# Altium schematic sheet Нижняя плата версия 3.0.SchDoc
size 594 x 420 mm; Author: ALTIUM GOSTBOM2.0 KEV; SheetNumber: 1; SheetTotal: 1; Обозначение_Код: НАПК0001.00.02Р; Наименование2: Модуль питания; п_Разраб_Р: Хейфец С.С.; п_Пров_Р: Хрущев А.С.; п_Утв_Р: Хейфец С.С.; Вид_документа_SCH: Схема принципиальная; Наименование_организации: Неясыти Аэро
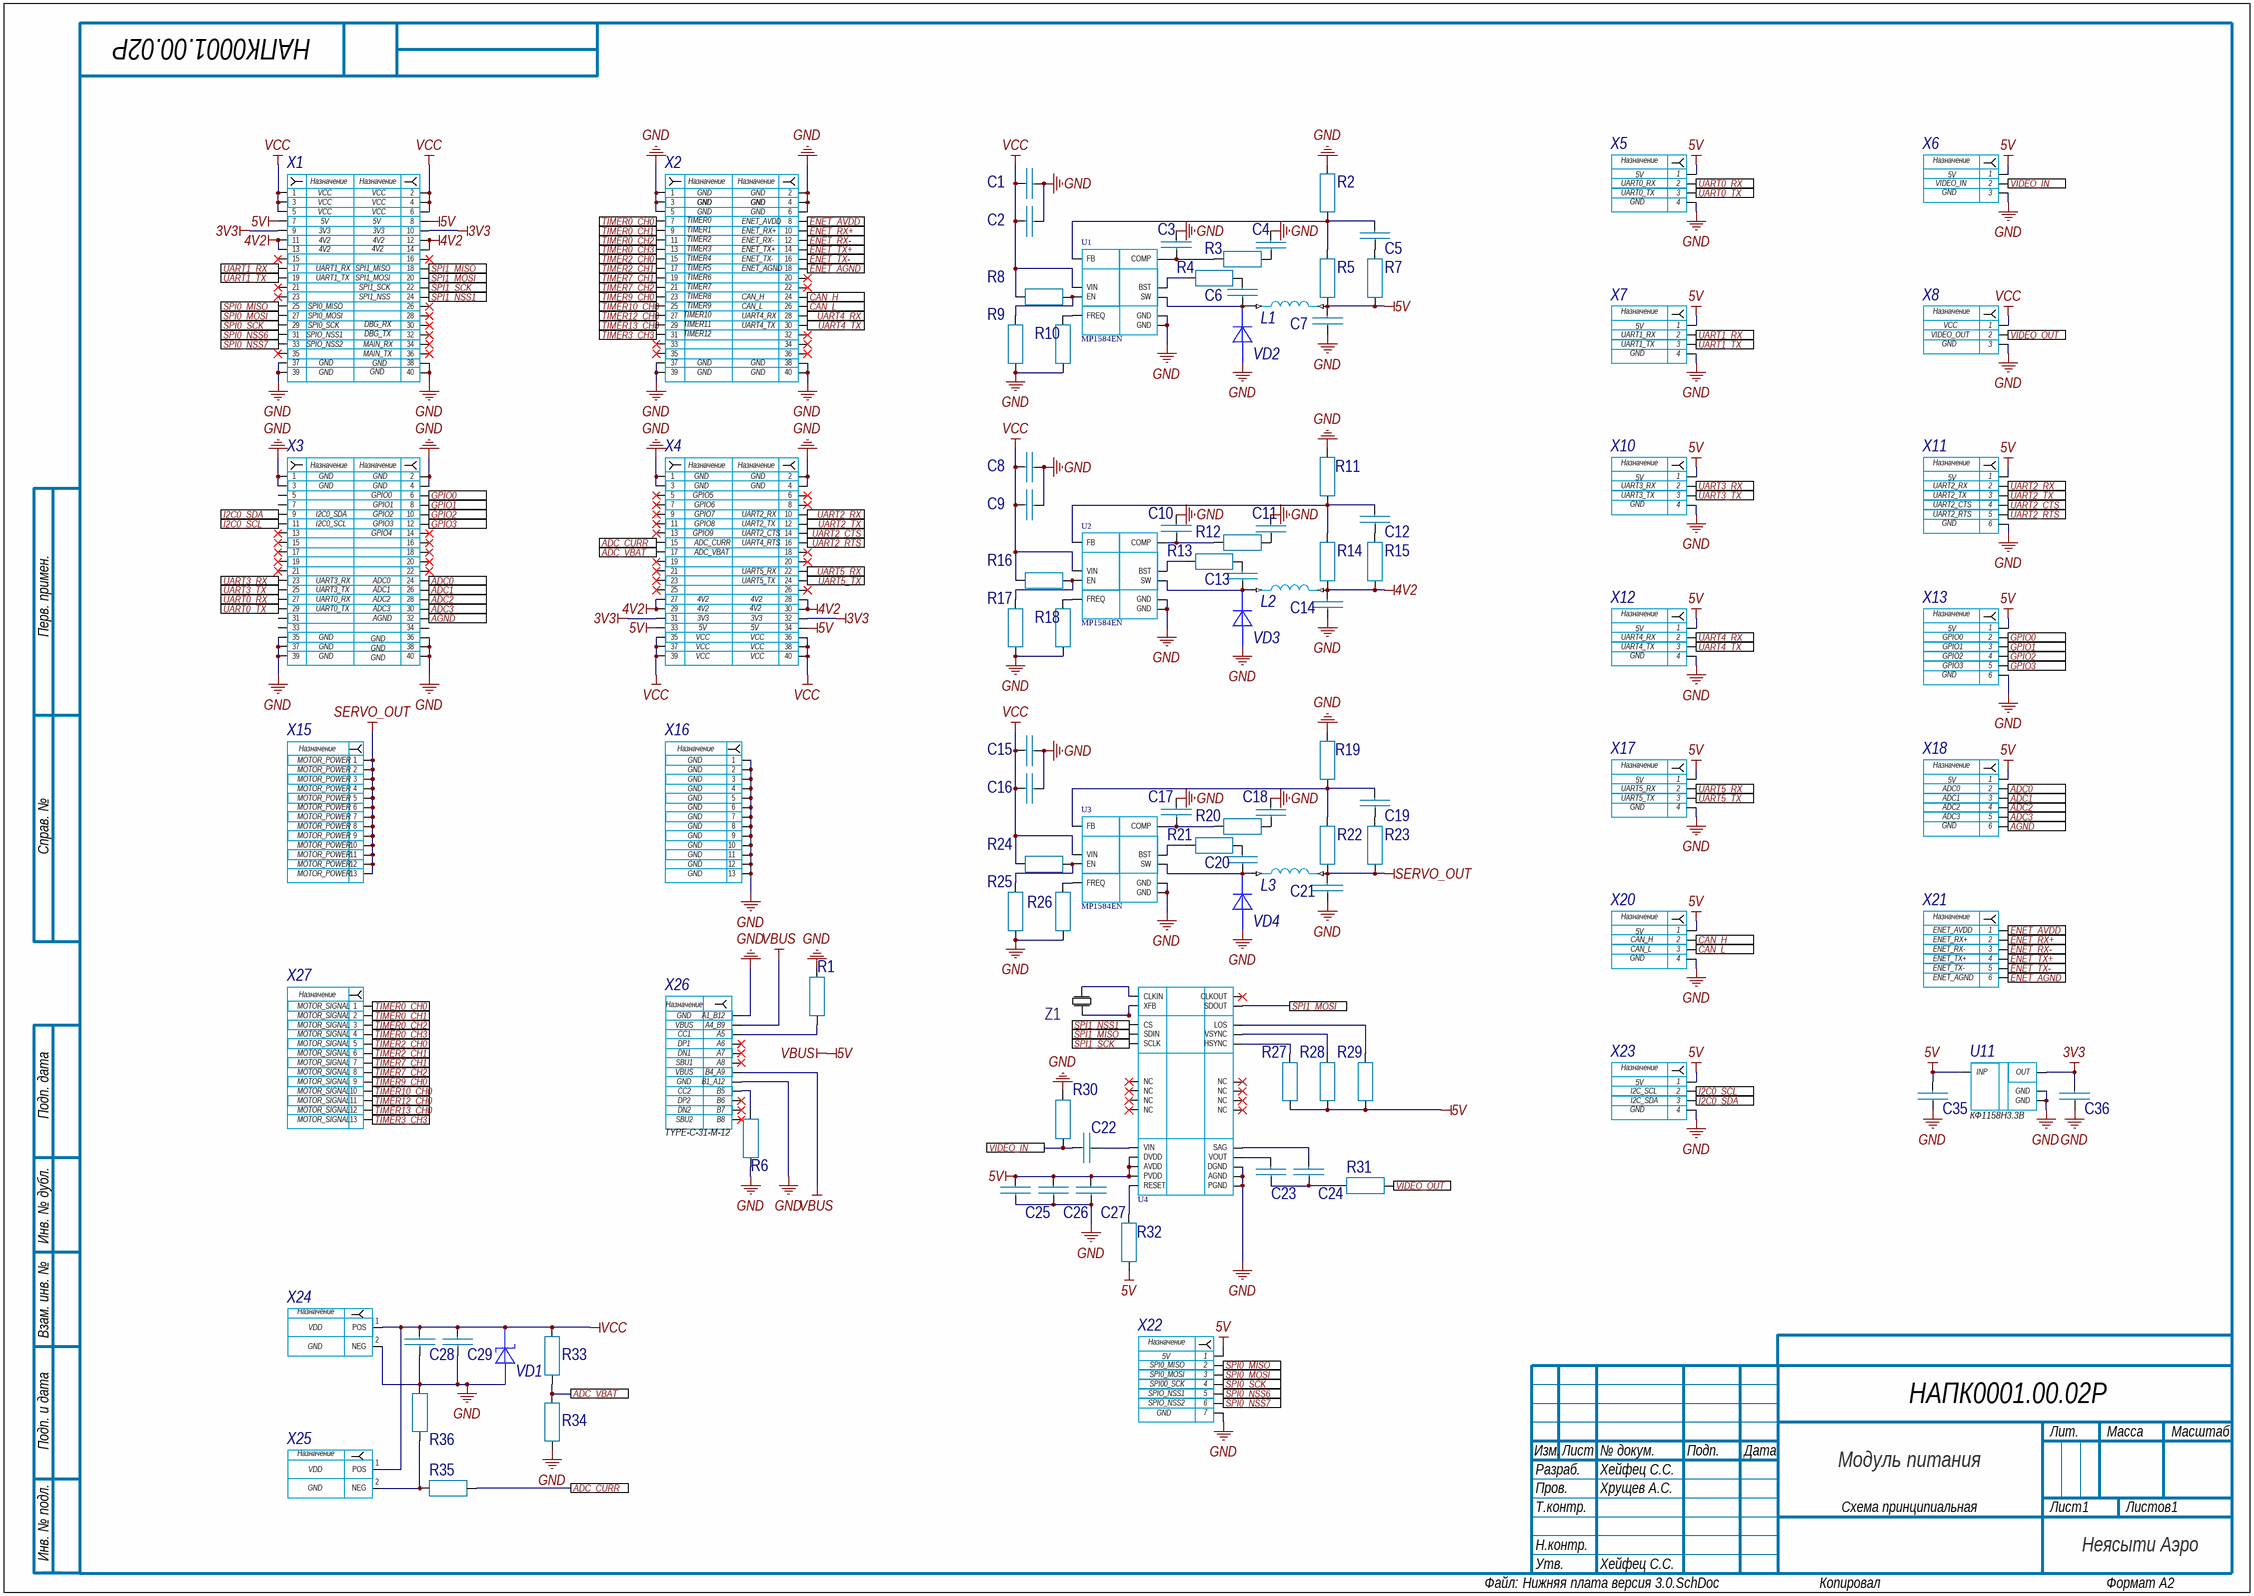
[diagram p0: Нижняя плата версия 3.0.SchDoc]

## Parts
C1  4u7  [C1206]  (value not drawn)
C2  100n  [C0603]  (value not drawn)
C3  1p  [C0603]  (value not drawn)
C4  220p  [C0603]  (value not drawn)
C5  (no value)  [C0603]
C6  100n  [C0603]  (value not drawn)
C7  22u  [C0603]  (value not drawn)
C8  4u7  [C1206]  (value not drawn)
C9  100n  [C0603]  (value not drawn)
C10  1p  [C0603]  (value not drawn)
C11  220p  [C0603]  (value not drawn)
C12  (no value)  [C0603]
C13  100n  [C0603]  (value not drawn)
C14  22u  [C0603]  (value not drawn)
C15  4u7  [C1206]  (value not drawn)
C16  100n  [C0603]  (value not drawn)
C17  1p  [C0603]  (value not drawn)
C18  220p  [C0603]  (value not drawn)
C19  (no value)  [C0603]
C20  100n  [C0603]  (value not drawn)
C21  22u  [C1206]  (value not drawn)
C22  (no value)  [C0603]
C23  22u  [C1206]  (value not drawn)
C24  22u  [C1206]  (value not drawn)
C25  100n  [C0603]  (value not drawn)
C26  100n  [C0603]  (value not drawn)
C27  100n  [C0603]  (value not drawn)
C28  22u  [C1206]  (value not drawn)
C29  22u  [C1206]  (value not drawn)
C35  (no value)  [C0603]
C36  (no value)  [C0603]
L1  4u7  [МИ-3]  (value not drawn)
L2  4u7  [МИ-3]  (value not drawn)
L3  4u7  [МИ-3]  (value not drawn)
R1  (no value)  [R0603]
R2  23K7  [R0603]  (value not drawn)
R3  133K  [R0603]  (value not drawn)
R4  0  [R0603]  (value not drawn)
R5  124K  [R0603]  (value not drawn)
R6  (no value)  [R0603]
R7  (no value)  [R0603]
R8  100K  [R0603]  (value not drawn)
R9  100K  [R0603]  (value not drawn)
R10  57K6  [R0603]  (value not drawn)
R11  29K4  [R0603]  (value not drawn)
R12  113K  [R0603]  (value not drawn)
R13  0  [R0603]  (value not drawn)
R14  124K  [R0603]  (value not drawn)
R15  (no value)  [R0603]
R16  100K  [R0603]  (value not drawn)
R17  100K  [R0603]  (value not drawn)
R18  57.6  [R0603]  (value not drawn)
R19  23K7  [R0603]  (value not drawn)
R20  113K  [R0603]  (value not drawn)
R21  0  [R0603]  (value not drawn)
R22  124K  [R0603]  (value not drawn)
R23  (no value)  [R0603]
R24  100K  [R0603]  (value not drawn)
R25  100K  [R0603]  (value not drawn)
R26  57.6  [R0603]  (value not drawn)
R27  1K  [R0603]  (value not drawn)
R28  1K  [R0603]  (value not drawn)
R29  1K  [R0603]  (value not drawn)
R30  75  [R0603]  (value not drawn)
R31  75  [R0603]  (value not drawn)
R32  10K  [R0603]  (value not drawn)
R33  100K  [R0603]  (value not drawn)
R34  10K  [R0603]  (value not drawn)
R35  10K  [R0603]  (value not drawn)
R36  0R001  [RESC6864X114N]  (value not drawn)
U1  MP1584EN  [SOIC127P600X170-9N]
U2  MP1584EN  [SOIC127P600X170-9N]
U3  MP1584EN  [SOIC127P600X170-9N]
U4  AT7456  [at7456]  (value not drawn)
U11  КФ1158Н3.3В  [SOT-428]
VD1  (no value)  [DO-214AA]
VD2  SS3P4  [DO-214AC]  (value not drawn)
VD3  SS3P4  [DO-214AC]  (value not drawn)
VD4  SS3P4  [DO-214AC]  (value not drawn)
X1  PLLD-1.27-40S  [Headr 2x20 male]  (value not drawn)
X2  PLLD-1.27-40S  [Headr 2x20 male]  (value not drawn)
X3  PLLD-1.27-40S  [Headr 2x20 male]  (value not drawn)
X4  PLLD-1.27-40S  [Headr 2x20 male]  (value not drawn)
X5  Molex Picoblade 0532610471  [PicoBlade 4pin]  (value not drawn)
X6  Molex Picoblade 0532610371  [PicoBlade 3pin]  (value not drawn)
X7  Molex Picoblade 0532610471  [PicoBlade 4pin]  (value not drawn)
X8  Molex Picoblade 0532610371  [PicoBlade 3pin]  (value not drawn)
X10  Molex Picoblade 0532610471  [PicoBlade 4pin]  (value not drawn)
X11  Molex Picoblade 0532610671  [PicoBlade 6pin]  (value not drawn)
X12  Molex Picoblade 0532610471  [PicoBlade 4pin]  (value not drawn)
X13  Molex Picoblade 0532610671  [PicoBlade 6pin]  (value not drawn)
X15  (no value)  [SERV]
X16  (no value)  [SERV]
X17  Molex Picoblade 0532610471  [PicoBlade 4pin]  (value not drawn)
X18  Molex Picoblade 0532610671  [PicoBlade 6pin]  (value not drawn)
X20  Molex Picoblade 0532610471  [PicoBlade 4pin]  (value not drawn)
X21  Molex Picoblade 0532610671  [PicoBlade 6pin]  (value not drawn)
X22  Molex Picoblade 0532610771  [PicoBlade 7pin]  (value not drawn)
X23  Molex Picoblade 0532610471  [PicoBlade 4pin]  (value not drawn)
X24  Amass XT-60-PW-M  [AMASS_XT60PW-M]  (value not drawn)
X25  Amass XT-60-PW-F  [AMASS_XT60PW-F]  (value not drawn)
X26  TYPE-C-31-M-12  [HRO_TYPE-C-31-M-12]
X27  (no value)  [SERV]
Z1  27MHz  [XTAL_NX5032GA-8.000M-STD-CSU-1]  (value not drawn)

## Ports
ADC0 (see Нижняя плата версия 3.0[1A]), ADC0 (see Нижняя плата версия 3.0[2A]), ADC1 (see Нижняя плата версия 3.0[1A]), ADC1 (see Нижняя плата версия 3.0[2A]), ADC2 (see Нижняя плата версия 3.0[1A]), ADC2 (see Нижняя плата версия 3.0[2B]), ADC3 (see Нижняя плата версия 3.0[1A]), ADC3 (see Нижняя плата версия 3.0[2B]), ADC_CURR (see Нижняя плата версия 3.0[1A]), ADC_CURR (see Нижняя плата версия 3.0[1B]), ADC_VBAT (see Нижняя плата версия 3.0[1A]), ADC_VBAT (see Нижняя плата версия 3.0[1B]), AGND (see Нижняя плата версия 3.0[1A]), AGND (see Нижняя плата версия 3.0[2B]), CAN_H (see Нижняя плата версия 3.0[1A]), CAN_H (see Нижняя плата версия 3.0[2B]), CAN_L (see Нижняя плата версия 3.0[1A]), CAN_L (see Нижняя плата версия 3.0[2B]), ENET_AGND (see Нижняя плата версия 3.0[1A]), ENET_AGND (see Нижняя плата версия 3.0[2B]), ENET_AVDD (see Нижняя плата версия 3.0[1A]), ENET_AVDD (see Нижняя плата версия 3.0[2B]), ENET_RX+ (see Нижняя плата версия 3.0[1A]), ENET_RX+ (see Нижняя плата версия 3.0[2B]), ENET_RX- (see Нижняя плата версия 3.0[1A]), ENET_RX- (see Нижняя плата версия 3.0[2B]), ENET_TX+ (see Нижняя плата версия 3.0[1A]), ENET_TX+ (see Нижняя плата версия 3.0[2B]), ENET_TX- (see Нижняя плата версия 3.0[1A]), ENET_TX- (see Нижняя плата версия 3.0[2B]), GPIO0 (see Нижняя плата версия 3.0[1A]), GPIO0 (see Нижняя плата версия 3.0[2A]), GPIO1 (see Нижняя плата версия 3.0[1A]), GPIO1 (see Нижняя плата версия 3.0[2A]), GPIO2 (see Нижняя плата версия 3.0[1A]), GPIO2 (see Нижняя плата версия 3.0[2A]), GPIO3 (see Нижняя плата версия 3.0[1A]), GPIO3 (see Нижняя плата версия 3.0[2A]), I2C0_SCL (see Нижняя плата версия 3.0[1A]), I2C0_SCL (see Нижняя плата версия 3.0[2B]), I2C0_SDA (see Нижняя плата версия 3.0[1A]), I2C0_SDA (see Нижняя плата версия 3.0[2B]), SPI0_MISO (see Нижняя плата версия 3.0[1A]), SPI0_MISO (see Нижняя плата версия 3.0[2B]), SPI0_MOSI (see Нижняя плата версия 3.0[1A]), SPI0_MOSI (see Нижняя плата версия 3.0[2B]), SPI0_NSS6 (see Нижняя плата версия 3.0[1A]), SPI0_NSS6 (see Нижняя плата версия 3.0[2B]), SPI0_NSS7 (see Нижняя плата версия 3.0[1A]), SPI0_NSS7 (see Нижняя плата версия 3.0[2B]), SPI0_SCK (see Нижняя плата версия 3.0[1A]), SPI0_SCK (see Нижняя плата версия 3.0[2B]), SPI1_MISO (see Нижняя плата версия 3.0[1A]), SPI1_MISO (see Нижняя плата версия 3.0[1B]), SPI1_MOSI (see Нижняя плата версия 3.0[1A]), SPI1_MOSI (see Нижняя плата версия 3.0[2B]), SPI1_NSS1 (see Нижняя плата версия 3.0[1A]), SPI1_NSS1 (see Нижняя плата версия 3.0[1B]), SPI1_SCK (see Нижняя плата версия 3.0[1A]), SPI1_SCK (see Нижняя плата версия 3.0[1B]), TIMER0_CH0 (see Нижняя плата версия 3.0[1A]), TIMER0_CH0 (see Нижняя плата версия 3.0[1B]), TIMER0_CH1 (see Нижняя плата версия 3.0[1A]), TIMER0_CH1 (see Нижняя плата версия 3.0[1B]), TIMER0_CH2 (see Нижняя плата версия 3.0[1A]), TIMER0_CH2 (see Нижняя плата версия 3.0[1B]), TIMER0_CH3 (see Нижняя плата версия 3.0[1A]), TIMER0_CH3 (see Нижняя плата версия 3.0[1B]), TIMER2_CH0 (see Нижняя плата версия 3.0[1A]), TIMER2_CH0 (see Нижняя плата версия 3.0[1B]), TIMER2_CH1 (see Нижняя плата версия 3.0[1A]), TIMER2_CH1 (see Нижняя плата версия 3.0[1B]), TIMER3_CH3 (see Нижняя плата версия 3.0[1A]), TIMER3_CH3 (see Нижняя плата версия 3.0[1B]), TIMER7_CH1 (see Нижняя плата версия 3.0[1A]), TIMER7_CH1 (see Нижняя плата версия 3.0[1B]), TIMER7_CH2 (see Нижняя плата версия 3.0[1A]), TIMER7_CH2 (see Нижняя плата версия 3.0[1B]), TIMER9_CH0 (see Нижняя плата версия 3.0[1A]), TIMER9_CH0 (see Нижняя плата версия 3.0[1B]), TIMER10_CH0 (see Нижняя плата версия 3.0[1A]), TIMER10_CH0 (see Нижняя плата версия 3.0[1B]), TIMER12_CH0 (see Нижняя плата версия 3.0[1A]), TIMER12_CH0 (see Нижняя плата версия 3.0[1B]), TIMER13_CH0 (see Нижняя плата версия 3.0[1A]), TIMER13_CH0 (see Нижняя плата версия 3.0[1B]), UART0_RX (see Нижняя плата версия 3.0[1A]), UART0_RX (see Нижняя плата версия 3.0[2A]), UART0_TX (see Нижняя плата версия 3.0[1A]), UART0_TX (see Нижняя плата версия 3.0[2A]), UART1_RX (see Нижняя плата версия 3.0[1A]), UART1_RX (see Нижняя плата версия 3.0[2A]), UART1_TX (see Нижняя плата версия 3.0[1A]), UART1_TX (see Нижняя плата версия 3.0[2A]), UART2_CTS (see Нижняя плата версия 3.0[1A]), UART2_CTS (see Нижняя плата версия 3.0[2A]), UART2_RTS (see Нижняя плата версия 3.0[1A]), UART2_RTS (see Нижняя плата версия 3.0[2A]), UART2_RX (see Нижняя плата версия 3.0[1A]), UART2_RX (see Нижняя плата версия 3.0[2A]), UART2_TX (see Нижняя плата версия 3.0[1A]), UART2_TX (see Нижняя плата версия 3.0[2A]), UART3_RX (see Нижняя плата версия 3.0[1A]), UART3_RX (see Нижняя плата версия 3.0[2A]), UART3_TX (see Нижняя плата версия 3.0[1A]), UART3_TX (see Нижняя плата версия 3.0[2A]), UART4_RX (see Нижняя плата версия 3.0[1A]), UART4_RX (see Нижняя плата версия 3.0[2A]), UART4_TX (see Нижняя плата версия 3.0[1A]), UART4_TX (see Нижняя плата версия 3.0[2A]), UART5_RX (see Нижняя плата версия 3.0[1A]), UART5_RX (see Нижняя плата версия 3.0[2A]), UART5_TX (see Нижняя плата версия 3.0[1A]), UART5_TX (see Нижняя плата версия 3.0[2A]), VIDEO_IN (see Нижняя плата версия 3.0[1B]), VIDEO_IN (see Нижняя плата версия 3.0[2A]), VIDEO_OUT (see Нижняя плата версия 3.0[2A]), VIDEO_OUT (see Нижняя плата версия 3.0[2B])

## Nets
3V3: C36.2 U11.3(OUT) X1.9 X1.10 X4.31 X4.32
4V2: C14.2 L2.2 R14.1 R15.1 X1.11 X1.12 X1.13 X1.14 X4.27 X4.28 X4.29 X4.30
5V: C7.2 C25.1 C26.1 C27.1 C35.2 L1.2 R5.1 R7.1 R27.1 R28.1 R29.1 R32.2 U4.3(DVDD) U4.21(AVDD) U4.24(PVDD) U11.1(INP) X1.7 X1.8 X4.33 X4.34 X5.1 X6.1 X7.1 X10.1 X11.1 X12.1 X13.1 X17.1 X18.1 X20.1 X22.1 X23.1 X26.A4_B9 X26.B4_A9  [also labelled VBUS]
GND: C1.1 C2.1 C3.1 C4.2 C7.1 C8.1 C9.1 C10.1 C11.2 C14.1 C15.1 C16.1 C17.1 C18.2 C21.1 C25.2 C26.2 C27.2 C28.1 C29.1 C35.1 C36.1 R1.2 R2.2 R6.2 R9.1 R10.1 R11.2 R17.1 R18.1 R19.2 R25.1 R26.1 R30.1 R34.2 R36.1 U1.5(GND) U1.9(GND) U2.5(GND) U2.9(GND) U3.5(GND) U3.9(GND) U4.4(DGND) U4.20(AGND) U4.23(PGND) U11.2(GND) U11.4(GND) VD1.1(А) VD2.1(А) VD3.1(А) VD4.1(А) X1.37 X1.38 X1.39 X1.40 X2.1 X2.2 X2.3 X2.4 X2.5 X2.6 X2.37 X2.38 X2.39 X2.40 X3.1 X3.2 X3.3 X3.4 X3.35 X3.36 X3.37 X3.38 X3.39 X3.40 X4.1 X4.2 X4.3 X4.4 X5.4 X6.3 X7.4 X8.3 X10.4 X11.6 X12.4 X13.6 X16.1 X16.2 X16.3 X16.4 X16.5 X16.6 X16.7 X16.8 X16.9 X16.10 X16.11 X16.12 X16.13 X17.4 X20.4 X22.7 X23.4 X24.2(NEG) X26.A1_B12 X26.B1_A12
SERVO_OUT: C21.2 L3.2 R22.1 R23.1 X15.1 X15.2 X15.3 X15.4 X15.5 X15.6 X15.7 X15.8 X15.9 X15.10 X15.11 X15.12 X15.13
VCC: C1.2 C2.2 C8.2 C9.2 C15.2 C16.2 C28.2 C29.2 R8.1 R16.1 R24.1 R33.1 U1.7(VIN) U2.7(VIN) U3.7(VIN) VD1.2(К) X1.1 X1.2 X1.3 X1.4 X1.5 X1.6 X4.35 X4.36 X4.37 X4.38 X4.39 X4.40 X8.1 X24.1(POS) X25.1(POS)
ADC0: X3.24 X18.2 ; port ADC0
ADC1: X3.26 X18.3 ; port ADC1
ADC2: X3.28 X18.4 ; port ADC2
ADC3: X3.30 X18.5 ; port ADC3
ADC_CURR: R35.2 X4.15 ; port ADC_CURR
ADC_VBAT: R33.2 R34.1 X4.17 ; port ADC_VBAT
AGND: X3.32 X18.6 ; port AGND
CAN_H: X2.24 X20.2 ; port CAN_H
CAN_L: X2.26 X20.3 ; port CAN_L
ENET_AGND: X2.18 X21.6 ; port ENET_AGND
ENET_AVDD: X2.8 X21.1 ; port ENET_AVDD
ENET_RX+: X2.10 X21.2 ; port ENET_RX+
ENET_RX-: X2.12 X21.3 ; port ENET_RX-
ENET_TX+: X2.14 X21.4 ; port ENET_TX+
ENET_TX-: X2.16 X21.5 ; port ENET_TX-
GPIO0: X3.6 X13.2 ; port GPIO0
GPIO1: X3.8 X13.3 ; port GPIO1
GPIO2: X3.10 X13.4 ; port GPIO2
GPIO3: X3.12 X13.5 ; port GPIO3
I2C0_SCL: X3.11 X23.2 ; port I2C0_SCL
I2C0_SDA: X3.9 X23.3 ; port I2C0_SDA
SPI0_MISO: X1.25 X22.2 ; port SPI0_MISO
SPI0_MOSI: X1.27 X22.3 ; port SPI0_MOSI
SPI0_NSS6: X1.31 X22.5 ; port SPI0_NSS6
SPI0_NSS7: X1.33 X22.6 ; port SPI0_NSS7
SPI0_SCK: X1.29 X22.4 ; port SPI0_SCK
SPI1_MISO: U4.9(SDIN) X1.18 ; port SPI1_MISO
SPI1_MOSI: U4.11(SDOUT) X1.20 ; port SPI1_MOSI
SPI1_NSS1: U4.8(CS) X1.24 ; port SPI1_NSS1
SPI1_SCK: U4.10(SCLK) X1.22 ; port SPI1_SCK
TIMER0_CH0: X2.7 X27.1 ; port TIMER0_CH0
TIMER0_CH1: X2.9 X27.2 ; port TIMER0_CH1
TIMER0_CH2: X2.11 X27.3 ; port TIMER0_CH2
TIMER0_CH3: X2.13 X27.4 ; port TIMER0_CH3
TIMER2_CH0: X2.15 X27.5 ; port TIMER2_CH0
TIMER2_CH1: X2.17 X27.6 ; port TIMER2_CH1
TIMER3_CH3: X2.31 X27.13 ; port TIMER3_CH3
TIMER7_CH1: X2.19 X27.7 ; port TIMER7_CH1
TIMER7_CH2: X2.21 X27.8 ; port TIMER7_CH2
TIMER9_CH0: X2.23 X27.9 ; port TIMER9_CH0
TIMER10_CH0: X2.25 X27.10 ; port TIMER10_CH0
TIMER12_CH0: X2.27 X27.11 ; port TIMER12_CH0
TIMER13_CH0: X2.29 X27.12 ; port TIMER13_CH0
UART0_RX: X3.27 X5.2 ; port UART0_RX
UART0_TX: X3.29 X5.3 ; port UART0_TX
UART1_RX: X1.17 X7.2 ; port UART1_RX
UART1_TX: X1.19 X7.3 ; port UART1_TX
UART2_CTS: X4.14 X11.4 ; port UART2_CTS
UART2_RTS: X4.16 X11.5 ; port UART2_RTS
UART2_RX: X4.10 X11.2 ; port UART2_RX
UART2_TX: X4.12 X11.3 ; port UART2_TX
UART3_RX: X3.23 X10.2 ; port UART3_RX
UART3_TX: X3.25 X10.3 ; port UART3_TX
UART4_RX: X2.28 X12.2 ; port UART4_RX
UART4_TX: X2.30 X12.3 ; port UART4_TX
UART5_RX: X4.22 X17.2 ; port UART5_RX
UART5_TX: X4.24 X17.3 ; port UART5_TX
VIDEO_IN: C22.1 R30.2 X6.2 ; port VIDEO_IN
VIDEO_OUT: R31.2 X8.2 ; port VIDEO_OUT
NetC3_2: C3.2 R3.1 U1.3(COMP)
NetC4_1: C4.1 R3.2
NetC5_1: C5.1 R7.2
NetC5_2: C5.2 R2.1 R5.2 U1.4(FB)
NetC6_1: C6.1 L1.1 U1.1(SW) VD2.2(К)
NetC6_2: C6.2 R4.2
NetC10_2: C10.2 R12.1 U2.3(COMP)
NetC11_1: C11.1 R12.2
NetC12_1: C12.1 R15.2
NetC12_2: C12.2 R11.1 R14.2 U2.4(FB)
NetC13_1: C13.1 L2.1 U2.1(SW) VD3.2(К)
NetC13_2: C13.2 R13.2
NetC17_2: C17.2 R20.1 U3.3(COMP)
NetC18_1: C18.1 R20.2
NetC19_1: C19.1 R23.2
NetC19_2: C19.2 R19.1 R22.2 U3.4(FB)
NetC20_1: C20.1 L3.1 U3.1(SW) VD4.2(К)
NetC20_2: C20.2 R21.2
NetC22_2: C22.2 U4.22(VIN)
NetC23_1: C23.1 C24.1 R31.1
NetC23_2: C23.2 U4.26(VOUT)
NetC24_2: C24.2 U4.25(SAG)
NetR1_1: R1.1 X26.A5
NetR4_1: R4.1 U1.8(BST)
NetR6_1: R6.1 X26.B5
NetR8_2: R8.2 R9.2 U1.2(EN)
NetR10_2: R10.2 U1.6(FREQ)
NetR13_1: R13.1 U2.8(BST)
NetR16_2: R16.2 R17.2 U2.2(EN)
NetR18_2: R18.2 U2.6(FREQ)
NetR21_1: R21.1 U3.8(BST)
NetR24_2: R24.2 R25.2 U3.2(EN)
NetR26_2: R26.2 U3.6(FREQ)
NetR27_2: R27.2 U4.18(HSYNC)
NetR28_2: R28.2 U4.17(VSYNC)
NetR29_2: R29.2 U4.12(LOS)
NetR32_1: R32.1 U4.19(RESET)
NetR35_1: R35.1 R36.2 X25.2(NEG)
NetU4_5: U4.5(CLKIN) Z1.2(X2)
NetU4_6: U4.6(XFB) Z1.1(X1)

Not connected (* = marked no-connect by the designer): U4 1(NC)* 2(NC)* 7(CLKOUT)* 13(NC)* 14(NC)* 15(NC)* 16(NC)* 27(NC)* 28(NC)*; X1 15* 16* 21* 23* 26* 28* 30* 32* 34* 35* 36*; X2 20* 22* 32* 33* 34* 35* 36*; X3 5 7 13* 14* 15* 16* 17* 18* 19* 20* 21* 22* 31 33 34; X4 5* 6* 7* 8* 9* 11* 13* 18* 19* 20* 21* 23* 25* 26*; X26 A6* A7* A8* B6* B7* B8*

## Notes on the sheet
- 5V
- (near X1) VCC
- (near X1) 5V
- (near X2) TIMER0
- (near X2) GND
- (near X2) ENET_AVDD
- (near X5) UART0_RX
- (near X5) UART0_TX
- GND
- (near X6) VIDEO_IN
- (near X1) UART1_RX
- (near X1) 3V3
- (near X1) 4V2
- (near X1) SPI1_MISO
- (near X2) TIMER1
- (near X2) TIMER2
- (near X2) TIMER3
- (near X2) TIMER4
- (near X2) TIMER5
- (near X2) ENET_RX+
- (near X2) ENET_RX-
- (near X2) ENET_TX+
- (near X2) ENET_TX-
- (near X2) ENET_AGND
- (near X1) UART1_TX
- (near X1) SPI0_MISO
- (near X1) SPI0_MOSI
- (near X1) SPI1_MOSI
- (near X1) SPI1_SCK
- (near X1) SPI1_NSS
- (near X2) TIMER6
- (near X2) TIMER7
- (near X2) TIMER8
- (near X2) TIMER9
- (near X2) TIMER10
- (near X2) CAN_H
- (near X2) CAN_L
- (near X2) UART4_RX
- (near X1) GND
- (near X1) SPI0_SCK
- (near X1) SPIO_NSS1
- (near X1) SPIO_NSS2
- (near X1) MAIN_RX
- (near X1) MAIN_TX
- (near X1) DBG_RX
- (near X1) DBG_TX
- (near X2) TIMER11
- (near X2) TIMER12
- (near X2) UART4_TX
- (near X7) UART1_TX
- (near X7) UART1_RX
- VCC
- (near X8) VIDEO_OUT
- (near X3) GND
- (near X3) GPIO1
- (near X3) GPIO0
- (near X4) GPIO6
- (near X4) GND
- (near X4) GPIO5
- (near X10) UART3_TX
- (near X10) UART3_RX
- (near X11) UART2_TX
- (near X11) UART2_RX
- (near X11) UART2_CTS
- (near X3) I2C0_SDA
- (near X3) I2C0_SCL
- (near X3) GPIO2
- (near X3) GPIO3
- (near X3) GPIO4
- (near X4) GPIO7
- (near X4) GPIO8
- (near X4) ADC_CURR
- (near X4) ADC_VBAT
- (near X4) GPIO9
- (near X4) UART2_RX
- (near X4) UART2_TX
- (near X4) UART2_CTS
- (near X4) UART4_RTS
- (near X11) UART2_RTS
- (near X3) UART3_RX
- (near X3) UART3_TX
- (near X3) UART0_RX
- (near X3) ADC0
- (near X3) ADC1
- (near X3) ADC2
- (near X4) 4V2
- (near X4) UART5_RX
- (near X4) UART5_TX
- (near X3) UART0_TX
- (near X3) ADC3
- (near X3) AGND
- (near X4) VCC
- (near X4) 5V
- (near X4) 3V3
- (near X12) UART4_TX
- (near X12) UART4_RX
- (near X13) GPIO1
- (near X13) GPIO0
- (near X13) GPIO3
- (near X13) GPIO2
- (near X15) MOTOR_POWER
- (near X16) GND
- (near X17) UART5_TX
- (near X17) UART5_RX
- ADC1
- ADC0
- ADC3
- ADC2
- (near X20) CAN_H
- (near X21) ENET_AVDD
- (near X21) ENET_RX+
- (near X20) CAN_L
- (near X21) ENET_RX-
- (near X21) ENET_TX+
- (near X21) ENET_TX-
- (near X21) ENET_AGND
- (near X27) MOTOR_SIGNAL
- (near X23) I2C_SDA
- (near X23) I2C_SCL
- (near X22) SPI0_MISO
- (near X22) SPI0_MOSI
- (near X22) SPI00_SCK
- (near X22) SPIO_NSS1
- (near X22) SPIO_NSS2
- Перв. примен.
- Справ. №
- Подп. дата
- Инв. № дубл.
- Взам. инв. №
- Подп. и дата
- Изм.
- Разраб.
- Лист
- № докум.
- Подп.
- Дата
- Лит.
- Масса
- Масштаб
- Пров.
- Т.контр.
- Листов
- Инв. № подл.
- Н.контр.
- Утв.
- ALTIUM GOSTBOM2.0 KEV
- Файл:
- Копировал
- Формат А2
- (in symbol Header 1x3) Назначение
- (in symbol Header 1x4) Назначение
- (in symbol Header 1x6) Назначение
- (in symbol Header 1x7) Назначение
- (in symbol Header 2x20) Назначение
- (in symbol SERVO) Назначение
- (in symbol TYPE-C-31-M-12) Назначение; GND; VBUS; CC1; DP1; DN1; SBU1; CC2; DP2; DN2; SBU2
- (in symbol XT60PW-M) Назначение; VDD; GND

## Library data of the parts
C1-C29 C35 C36 = C1_POSTOYANNYJ: Конденсатор постоянной емкости
  C1 C8 C15: Value: 4u7
  C2 C6 C9 C13 C16 C20 C25-C27: Value: 100n
  C3 C10 C17: Value: 1p
  C4 C11 C18: Value: 220p
  C7 C14 C21 C23 C24 C28 C29: Value: 22u
L1-L3 = Inductor: Описание свойств компонента; Value: 4u7
R1-R36 = R1_POSTOYANNYJ: Резистор постоянный
  R2 R19: Value: 23K7
  R3: Value: 133K
  R4 R13 R21: Value: 0
  R5 R14 R22: Value: 124K
  R8 R9 R16 R17 R24 R25 R33: Value: 100K
  R10: Value: 57K6
  R11: Value: 29K4
  R12 R20: Value: 113K
  R18 R26: Value: 57.6
  R27-R29: Value: 1K
  R30 R31: Value: 75
  R32 R34 R35: Value: 10K
  R36: Value: 0R001
U1-U3 = MP1584EN: DC-DC; Value: MP1584EN
U4 = AT7456: OSD; Value: AT7456
U11 = КФ1158Н: LDO; Value: КФ1158Н3.3В
VD1 = Schottky: Type: Диод; Published: 18.05.2010; Publisher: Andrew Danich
VD2-VD4 = Diode: Type: Диод; Published: 18.05.2010; Publisher: Andrew Danich; Value: SS3P4
X1-X4 = Header 2x20: Value: PLLD-1.27-40S
X5 X7 X10 X12 X17 X20 X23 = Header 1x4: Value: Molex Picoblade 0532610471
X6 X8 = Header 1x3: Value: Molex Picoblade 0532610371
X11 X13 X18 X21 = Header 1x6: Value: Molex Picoblade 0532610671
X15 X16 X27 = SERVO
X22 = Header 1x7: Value: Molex Picoblade 0532610771
X24 X25 = XT60PW-M
  X24: Value: Amass XT-60-PW-M
  X25: Value: Amass XT-60-PW-F
Z1 = KX-38T: Value: 27MHz
X26 = TYPE-C-31-M-12: Value: TYPE-C-31-M-12